# EAGLE design STM32_CANbus_V01 (EAGLE 9.2.2)
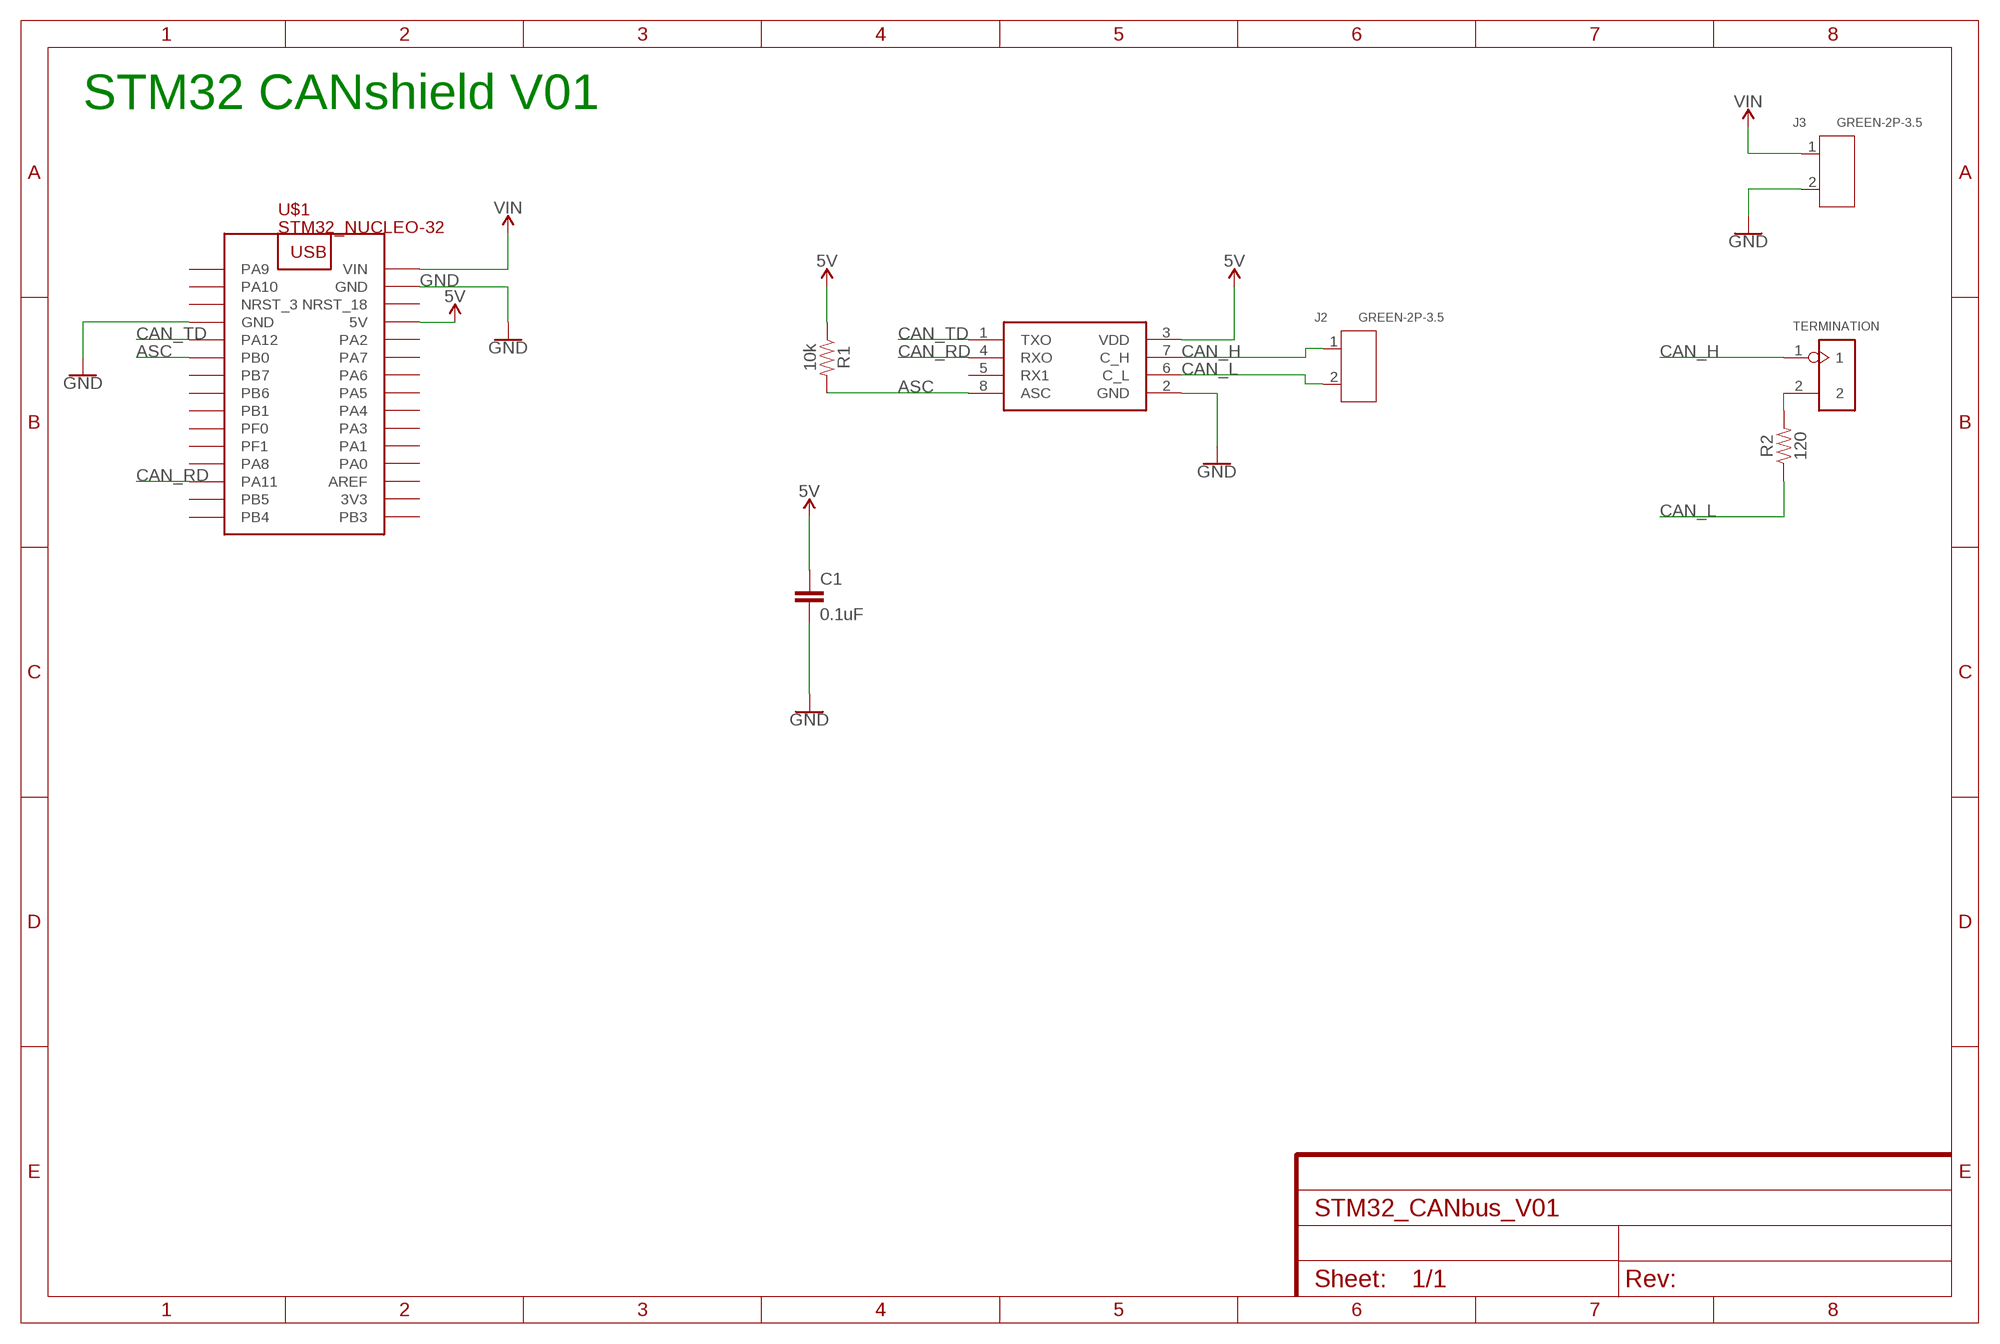
[diagram p0: schematic, sheet 1]

## Parts
C  L9616  [SO8]
C1  0.1uF  1.0UF-0805-25V-10%  [0805]
J2  GREEN-2P-3.5  SCREW-TERMINAL-GREEN(2P-3.5)  [H2-3.5-7.0X7.0MM]
J3  GREEN-2P-3.5  SCREW-TERMINAL-GREEN(2P-3.5)  [H2-3.5-7.0X7.0MM]
R1  10k  RESISTOR0805  [0805]
R2  120  RESISTOR1206  [1206]
TERMINATION  DIP-BLACK-JUMPER  [H2-2.54]
U$1  STM32_NUCLEO-32  [STM32_NUCLEO-32]

## Nets
5V: C1.1 C.3(VDD) R1.1 U$1.5V
ASC: C.8(ASC) R1.2 U$1.PB0
CAN_H: C.7(C_H) J2.1 TERMINATION.1
CAN_L: C.6(C_L) J2.2 R2.1
CAN_RD: C.4(RXO) U$1.PA11
CAN_TD: C.1(TXO) U$1.PA12
GND: C1.2 C.2(GND) J3.2 U$1.GND@4(GND) U$1.GND@17(GND)
N$2: R2.2 TERMINATION.2
VIN: J3.1 U$1.VIN
Unconnected: C.5(RX1) U$1.AREF U$1.NRST_3 U$1.NRST_18 U$1.PA0 U$1.PA1 U$1.PA2 U$1.PA3 U$1.PA4 U$1.PA5 U$1.PA6 U$1.PA7 U$1.PA8 U$1.PA9 U$1.PA10 U$1.PB1 U$1.PB3 U$1.PB4 U$1.PB5 U$1.PB6 U$1.PB7 U$1.PF0 U$1.PF1

## Notes on the sheet
- STM32 CANshield V01

## Power pins joined to a net without a drawn wire
3V3: U$1.3V3

## Library data of the parts
C = L9616:L9616; AVAILABILITY: Unavailable; DESCRIPTION: L9616 Series 5.5 V 1 MBd Rate SMT High Speed Can Bus Transceiver - SOIC-8; MF: STMicroelectronics; MP: L9616; PACKAGE: SO-8 STMicroelectronics; PRICE: None
C1 = SparkFun-Capacitors:1.0UF: 1µF ceramic capacitors A capacitor is a passive two-terminal electrical component used to store electrical energy temporarily in an electric field.; PROD_ID: CAP-08064; VALUE: 1.0uF
J2 J3 = Seeed-Connector:SCREW-TERMINAL-GREEN(2P-3.5): 320110028
R1 R2 = SparkFun-Resistors:RESISTOR: Generic Resistor Package
TERMINATION = Seeed-Connector:DIP-BLACK-JUMPER: 320190003
U$1 = Stm32_Nucleo-32:STM32_NUCLEO-32: STM32_NUCLEO-32

## Net classes
0 default: width 0.254 mm, drill 0.4 mm, clearance 0.203 mm

## Board
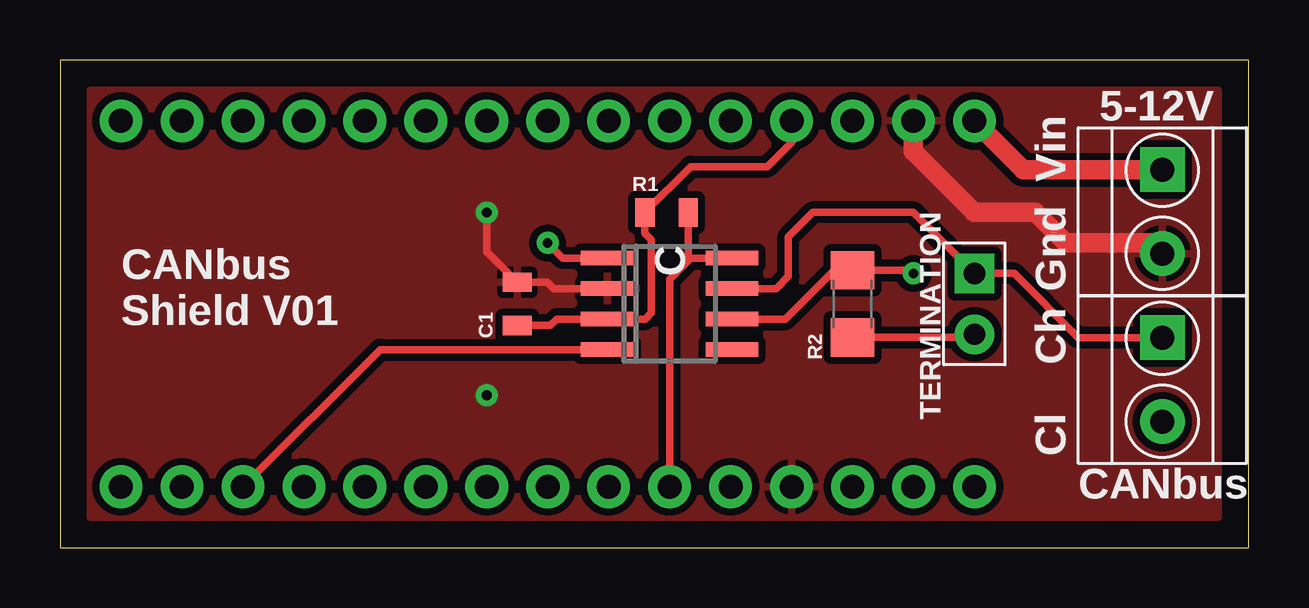
[diagram p1: board, top side]
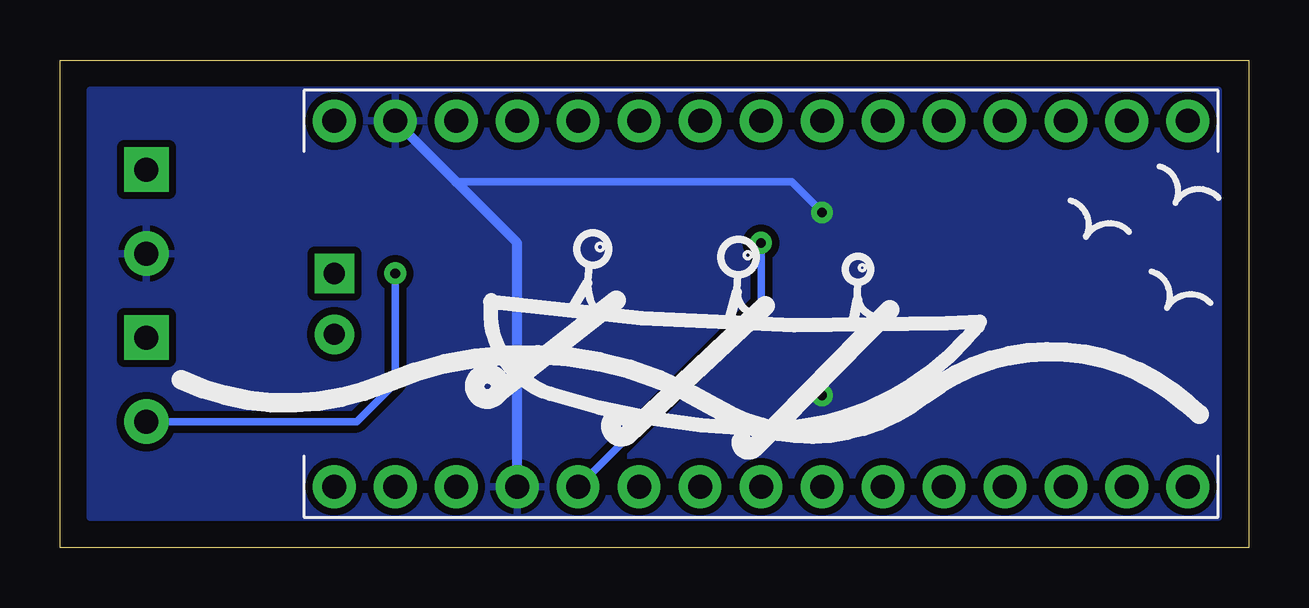
[diagram p2: board, bottom side, seen from below]

Size 49.53 x 20.32 mm. Coordinates in mm from the lower left corner, seen from the top.
Outline: 0,0 49.53,0 49.53,20.32 0,20.32 0,0
Copper layers (1*16): Top 0.035mm / dielectric 1.5mm / Bottom 0.035mm
Design rules "Modified-SparkFun-2-layer-STANDARD": minimum track width 10mil, minimum drill 15mil, track to track 10mil, track to pad 8mil, pad to pad 8mil, via to via 10mil, smd to smd 8mil, copper to edge 8mil, drill to drill 8mil, minimum pad ring 10mil, minimum via ring 10mil, stop-mask expansion 4mil, vias tented up to drill 25mil, thermal gap 10mil

### Footprints (pad centres in the part's own frame; a part is rotated, then mirrored left to right if it is on the bottom)
SO8 = smd 0.6 x 2.2: 1 -1.905,-2.6; 2 -0.635,-2.6; 3 0.635,-2.6; 4 1.905,-2.6; 5 1.905,2.6; 6 0.635,2.6; 7 -0.635,2.6; 8 -1.905,2.6
0805 = smd 0.8 x 1.2: 1 -0.9,0; 2 0.9,0
H2-3.5-7.0X7.0MM = drill 1 pad 1.85 square: 1 -1.75,0 | drill 1 pad 1.85: 2 1.75,0
1206 = smd 1.6 x 1.8: 1 -1.4,0; 2 1.4,0
H2-2.54 = drill 0.889 pad 1.651 square: 1 0,1.27 | drill 0.889 pad 1.651: 2 0,-1.27
STM32_NUCLEO-32 = drill 1 pad 1.778: 3V3 16.51,3.81; 5V 16.51,29.21; AREF 16.51,6.35; GND@4 1.27,29.21; GND@17 16.51,34.29; NRST_3 1.27,31.75; NRST_18 16.51,31.75; PA0 16.51,8.89; PA1 16.51,11.43; PA2 16.51,26.67; PA3 16.51,13.97; PA4 16.51,16.51; PA5 16.51,19.05; PA6 16.51,21.59; PA7 16.51,24.13; PA8 1.27,8.89; PA9 1.27,36.83; PA10 1.27,34.29; PA11 1.27,6.35; PA12 1.27,26.67; PB0 1.27,24.13; PB1 1.27,16.51; PB3 16.51,1.27; PB4 1.27,1.27; PB5 1.27,3.81; PB6 1.27,19.05; PB7 1.27,21.59; PF0 1.27,13.97; PF1 1.27,11.43; VIN 16.51,36.83

### Placement (x,y rotation side)
C  25.4,10.16 270 top
C1  19.05,10.16 90 top
J2  45.93,7 270 top
J3  45.93,14 270 top
R1  25.27,13.97 0 top
R2  33.02,10.16 270 top
TERMINATION  38.1,10.16 0 top
U$1  1.27,1.27 90 bottom

### Tracks (layer width: path | path; a pad name or v marks a point on that pad's centre or on a via)
5V
  Top 0.305: C1.1 20.44,9.26 20.7,9.53 C.3 24.38,9.53 24.64,9.78 24.64,12.83 24.37,13.09 R1.1 26.28,15.88 29.46,15.88 30.48,16.89 U$1.5V
ASC
  Top 0.305: C.8 26.29,12.06 | 26.29,12.06 26.16,12.19 26.17,12.2 R1.2 | U$1.PB0 25.4,11.18 26.29,12.06
CAN_H
  Top 0.305: C.7 29.84,10.79 30.35,11.3 30.35,12.95 31.37,13.97 35.56,13.97 TERMINATION.1 39.75,11.43 42.43,8.75 J2.1
CAN_L  (via drill 0.4)
  Top 0.305: C.6 30.23,9.53 32.26,11.56 R2.1 35.43,11.56 v35.56,11.43
  Bottom 0.305: J2.2 37.17,5.25 35.56,6.86 v35.56,11.43
CAN_RD
  Top 0.305: U$1.PA11 13.34,8.26 C.4
CAN_TD  (via drill 0.4)
  Top 0.305: C.1 20.95,12.06 v20.32,12.7
  Bottom 0.305: v20.32,12.7 20.32,10.16 U$1.PA12
GND  (via drill 0.4)
  Top 0.305: C.2 20.57,10.79 20.31,11.06 C1.2 17.78,12.33 v17.78,13.97
  Top 0.813: J3.2 45.48,12.7 41.91,12.7 40.64,13.97 38.1,13.97 35.56,16.51 U$1.GND@17
  Bottom 0.305: v17.78,13.97 19.05,15.24 33.02,15.24
  Bottom 0.406: U$1.GND@4 30.48,12.7 33.02,15.24 U$1.GND@17
  other vias: 17.78,6.35
  pour Bottom (isolate 0.305): 1.27,1.27 48.26,1.27 48.26,19.05 1.27,19.05
  pour Top (isolate 0.305): 1.27,1.27 48.26,1.27 48.26,19.05 1.27,19.05
N$2
  Top 0.305: R2.2 37.97,8.76 TERMINATION.2
VIN
  Top 0.813: U$1.VIN 40.13,15.75 J3.1

### Text on the board
tNames: 5-12V | Vin | Gnd | CANbus / Shield V01 | Ch | Cl | CANbus